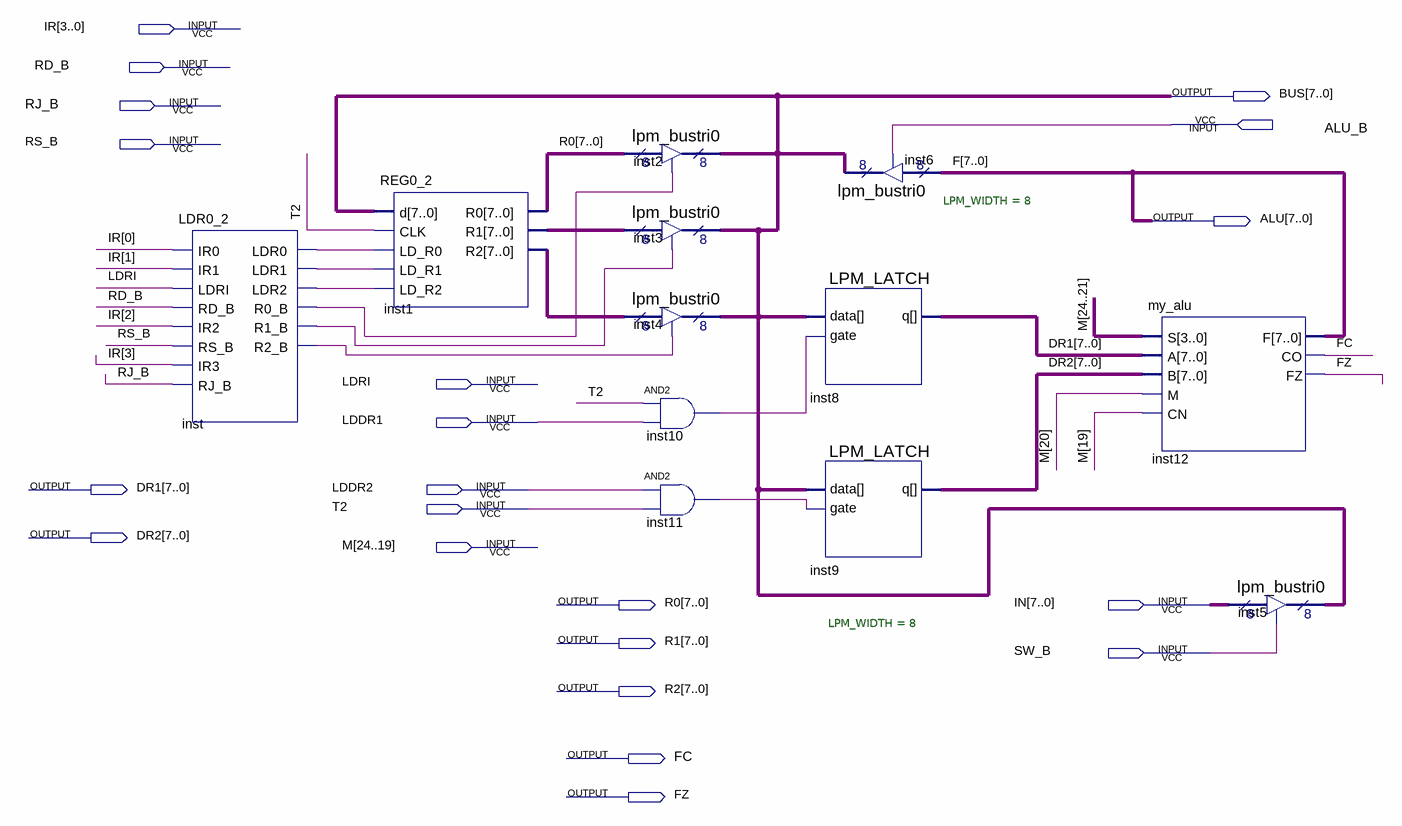
[diagram p0: schematic sheet]
// Quartus schematic ALU_MD.bdf as structural Verilog: 12 symbols, 21 pins
module ALU_MD (
  input  [3:0] IR,
  input  RD_B,
  input  RJ_B,
  input  ALU_B,
  input  RS_B,
  input  LDRI,
  input  LDDR1,
  input  LDDR2,
  input  T2,
  input  [24:19] M,
  input  [7:0] IN,
  input  SW_B,
  output [7:0] BUS,
  output [7:0] ALU,
  output [7:0] DR1,
  output [7:0] DR2,
  output [7:0] R0,
  output [7:0] R1,
  output [7:0] R2,
  output FC,
  output FZ
);

  wire inst10_out, inst11_out, inst_ldr0, inst_ldr1, inst_ldr2, inst_r0_b, inst_r1_b, inst_r2_b;
  wire [7:0] inst1_r1, inst1_r2;

  LDR0_2 inst (
    .IR0(IR[0]), .IR1(IR[1]), .LDRI(LDRI), .RD_B(RD_B), .IR2(IR[2]), .RS_B(RS_B), .IR3(IR[3]), .RJ_B(RJ_B),
    .LDR0(inst_ldr0), .LDR1(inst_ldr1), .LDR2(inst_ldr2), .R0_B(inst_r0_b), .R1_B(inst_r1_b), .R2_B(inst_r2_b));
  REG0_2 inst1 (
    .d(BUS), .CLK(T2), .LD_R0(inst_ldr0), .LD_R1(inst_ldr1), .LD_R2(inst_ldr2), .R0(R0), .R1(inst1_r1),
    .R2(inst1_r2));
  lpm_bustri0 inst2 (.enabledt(inst_r0_b), .data(R0), .tridata(BUS));
  lpm_bustri0 inst3 (.enabledt(inst_r1_b), .data(inst1_r1), .tridata(BUS));
  lpm_bustri0 inst4 (.enabledt(inst_r2_b), .data(inst1_r2), .tridata(BUS));
  and inst10 (inst10_out, T2, LDDR1);
  and inst11 (inst11_out, LDDR2, T2);
  LPM_LATCH #(.LPM_WIDTH(8)) inst8 (.data(BUS), .gate(inst10_out), .q(DR1));
  LPM_LATCH #(.LPM_WIDTH(8)) inst9 (.data(BUS), .gate(inst11_out), .q(DR2));
  lpm_bustri0 inst6 (.enabledt(ALU_B), .data(ALU), .tridata(BUS));
  my_alu inst12 (.S(M[24:21]), .A(DR1), .B(DR2), .M(M[20]), .CN(M[19]), .F(ALU), .CO(FC), .FZ(FZ));
  lpm_bustri0 inst5 (.enabledt(SW_B), .data(IN), .tridata(BUS));

  // Other names for the same wires on the sheet: F[7:0] = ALU
endmodule
